# EAGLE design OP_Current_Fun-V0 (EAGLE 6.3)
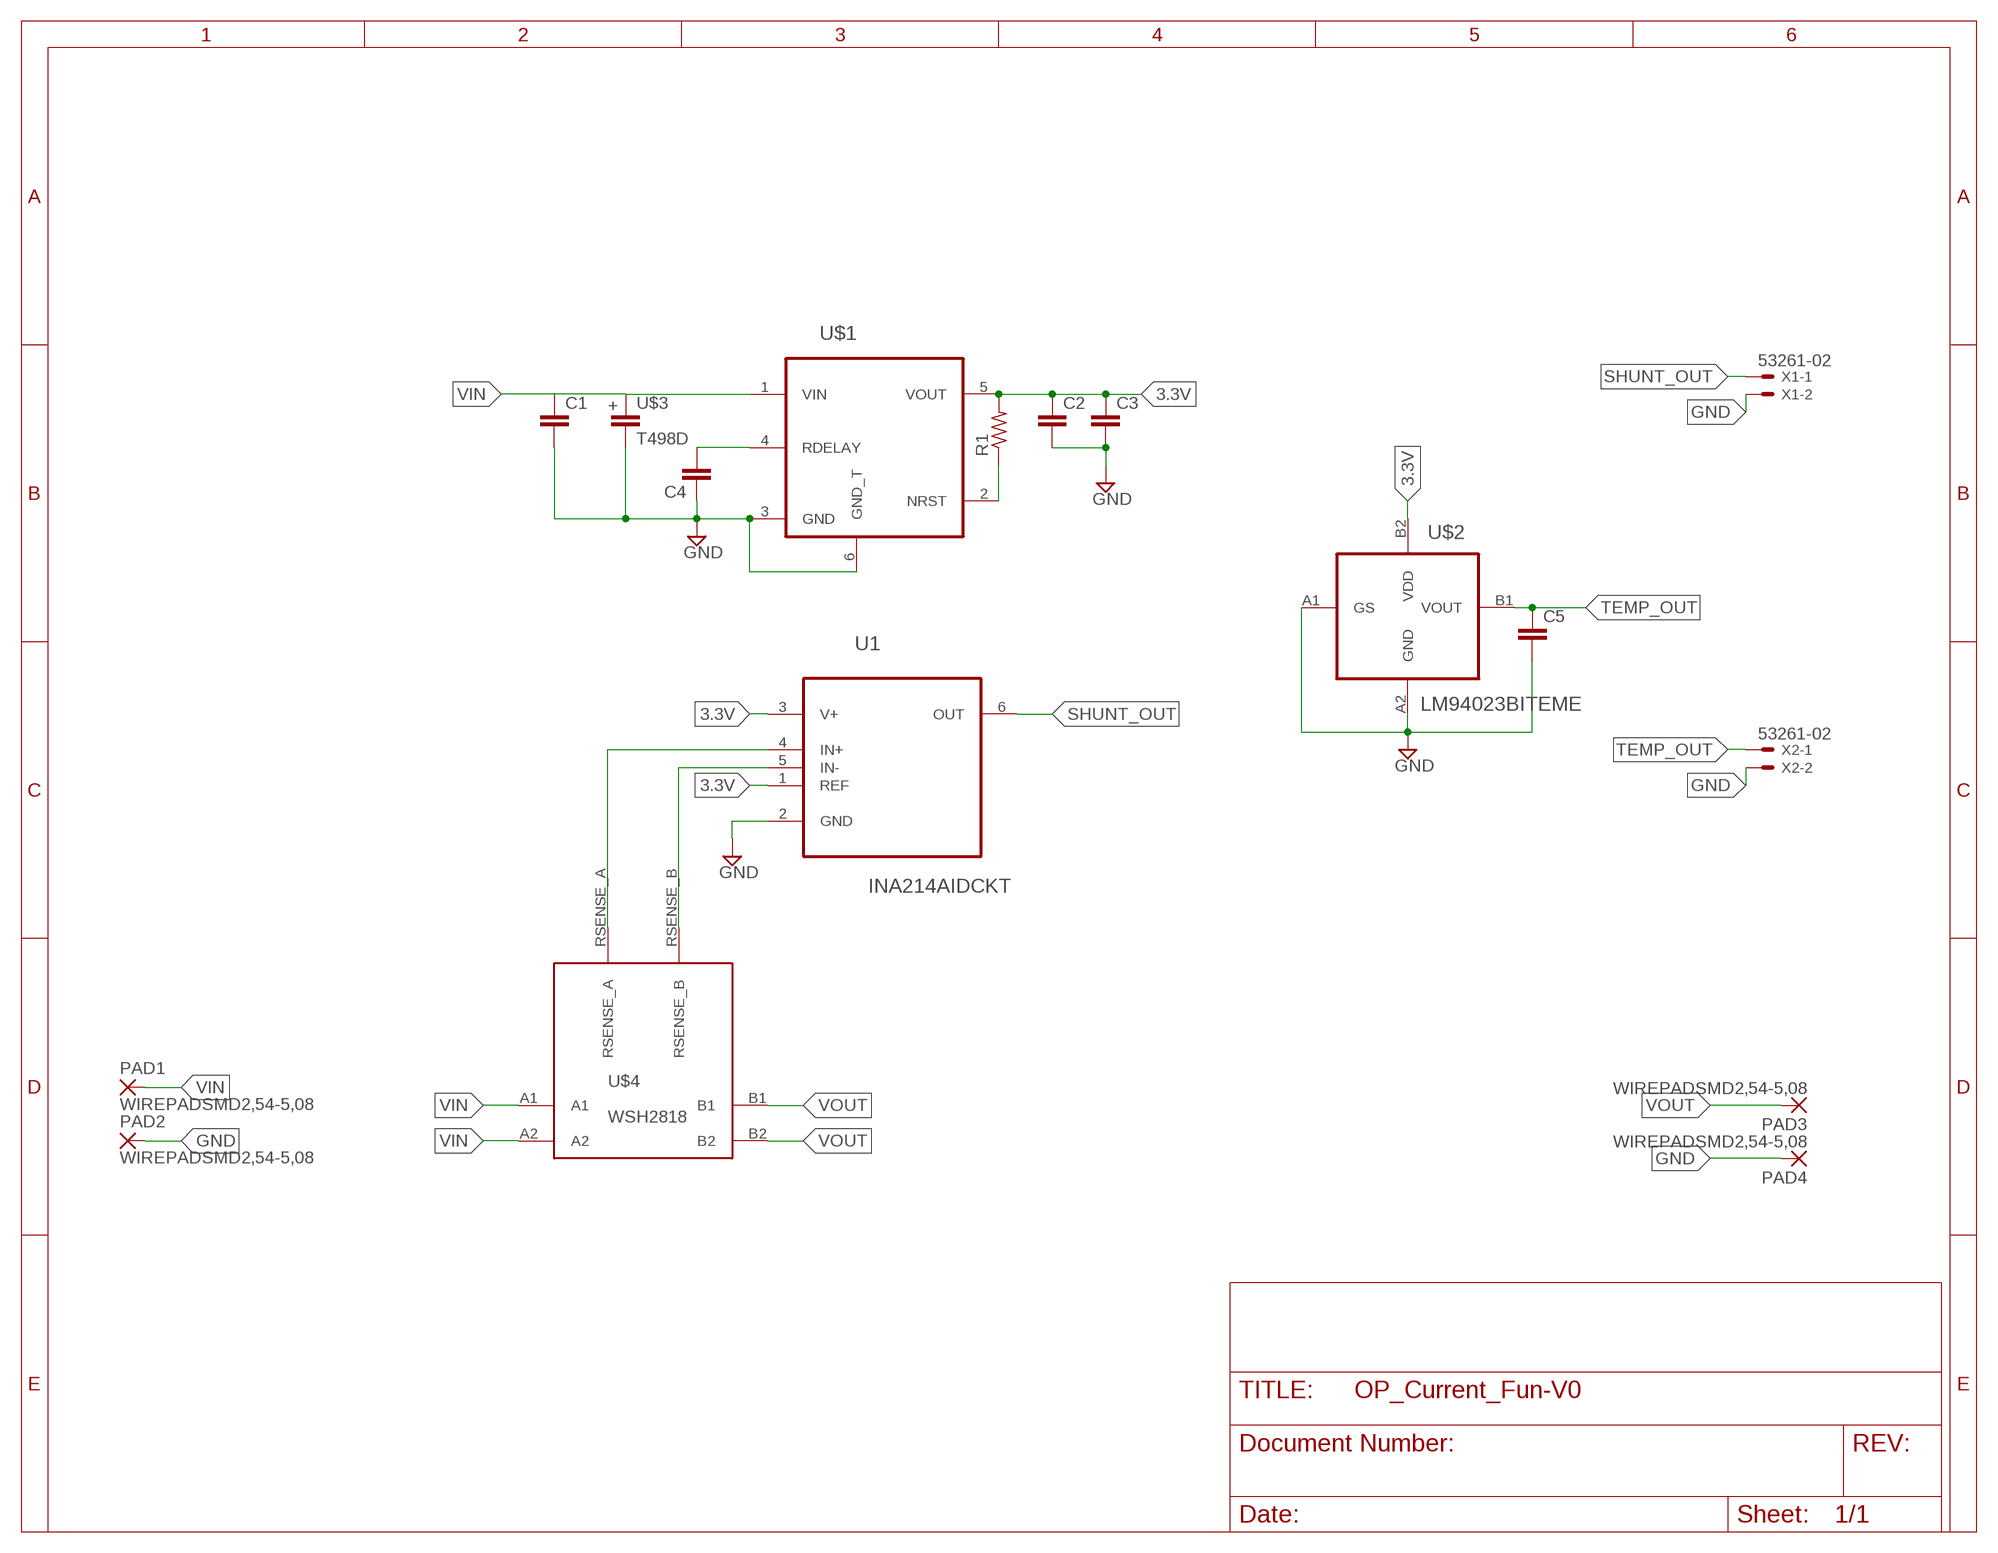
[diagram p0: schematic, sheet 1]

## Parts
C1  C-EUC0603K  [C0603K]
C2  C-EUC0603K  [C0603K]
C3  C-EUC0603K  [C0603K]
C4  C-EUC0805K  [C0805K]
C5  C-EUC0603K  [C0603K]
PAD1  WIREPADSMD2,54-5,08  [SMD2,54-5,08]
PAD2  WIREPADSMD2,54-5,08  [SMD2,54-5,08]
PAD3  WIREPADSMD2,54-5,08  [SMD2,54-5,08]
PAD4  WIREPADSMD2,54-5,08  [SMD2,54-5,08]
R1  R-US_R0402  [R0402]
U1  INA214AIDCKT  [SOT65P210X110-6N]
U$1  TPS7A6033-Q1  [TO-263-5]
U$2  LM94023BITEME  [BGA4C40P2X2_76X76X63]
U$3  T498D  [CT7343]
U$4  WSH2818  [2818]
X1  53261-02  [53261-02]
X2  53261-02  [53261-02]

## Nets
3.3V: C2.1 C3.1 R1.2 U1.1(REF) U1.3(V+) U$1.5(VOUT) U$2.B2(VDD)
GND: C1.2 C2.2 C3.2 C4.1 C5.2 PAD2.1(P) PAD4.1(P) U1.2(GND) U$1.3(GND) U$1.6(GND_T) U$2.A1(GS) U$2.A2(GND) U$3.- X1.2 X2.2
N$1: U1.4(IN+) U$4.RSENSE_A
N$2: U1.5(IN-) U$4.RSENSE_B
N$4: C4.2 U$1.4(RDELAY)
N$9: R1.1 U$1.2(NRST)
SHUNT_OUT: U1.6(OUT) X1.1
TEMP_OUT: C5.1 U$2.B1(VOUT) X2.1
VIN: C1.1 PAD1.1(P) U$1.1(VIN) U$3.+ U$4.A1 U$4.A2
VOUT: PAD3.1(P) U$4.B1 U$4.B2

## Library data of the parts
C1-C5 = rcl:C-EU: CAPACITOR, European symbol
PAD1-PAD4 = wirepad:WIREPAD: Wire PAD connect wire on PCB
R1 = rcl:R-US_: RESISTOR, American symbol
U1 = TI:INA214AIDCKT: CURRENT SHUNT MONITOR; MPN: INA214AIDCKT; OC_FARNELL: 1754262; OC_NEWARK: 05N1041; PACKAGE: SC-70-6; SUPPLIER: Texas Instruments
U$1 = TI_TPS:TPS7A6033-Q1: TPS7A6033-Q1
U$2 = TI:LM94023BITEME
U$3 = Kemet:T498D: Kemet T498 D series Tantalum SMD Cap
U$4 = VISHAY:WSH2818
X1 X2 = con-molex:53?-02: CONNECTOR wire to board 1.25 mm (.049 inch) pitch header; OC_FARNELL: 1125373; OC_NEWARK: unknown

## Board
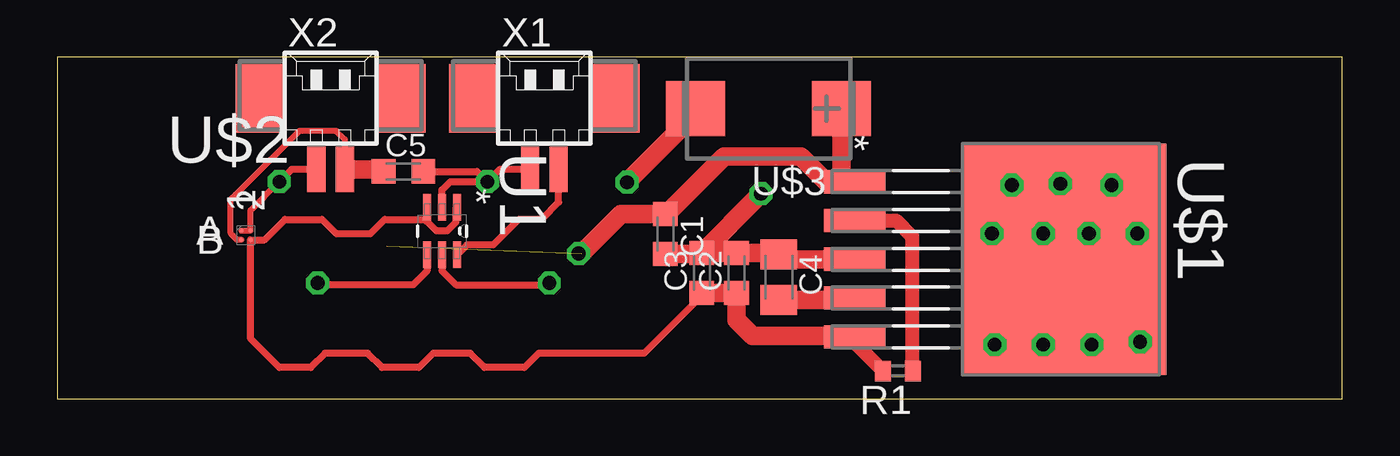
[diagram p1: board, top side]
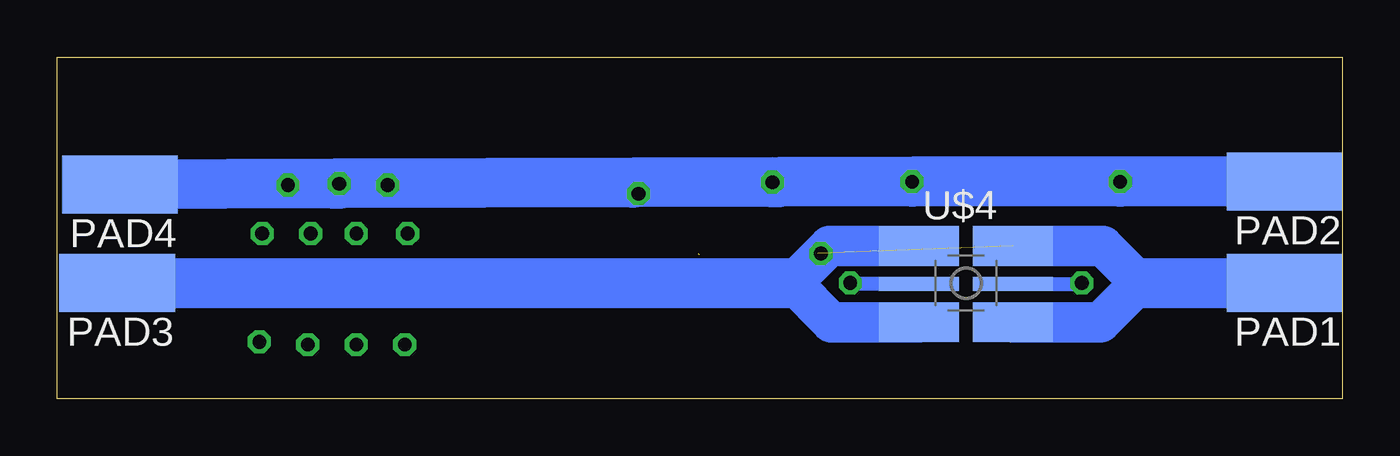
[diagram p2: board, bottom side, seen from below]

Size 56.38 x 15 mm. Coordinates in mm from the lower left corner, seen from the top.
Outline: 0,0 56.38,0 56.38,15 0,15 0,0
Copper layers (1*16): Top 0.035mm / dielectric 1.5mm / Bottom 0.035mm
Design rules "default": minimum track width 10mil, minimum drill 24mil, track to track 8mil, track to pad 8mil, pad to pad 8mil, via to via 8mil, smd to smd 8mil, copper to edge 40mil, drill to drill 8mil, minimum pad ring 10mil, minimum via ring 8mil, stop-mask expansion 4mil, vias tented up to drill 0mil, thermal gap 10mil

### Footprints (pad centres in the part's own frame; a part is rotated, then mirrored left to right if it is on the bottom)
C0603K = smd 1.05 x 1.08: 1 -0.875,0; 2 0.875,0
C0805K = smd 1.3 x 1.6: 1 -1,0; 2 1,0
SMD2,54-5,08 = smd 2.54 x 5.08: 1 0,0
R0402 = smd 0.7 x 0.9: 1 -0.65,0; 2 0.65,0
SOT65P210X110-6N = smd 1.168 x 0.356: 1 -1.041,0.66; 2 -1.041,0; 3 -1.041,-0.66; 4 1.041,-0.66; 5 1.041,0; 6 1.041,0.66
TO-263-5 = smd 1.016 x 2.692: 1 -3.404,-7.772; 2 -1.702,-7.772; 3 0,-7.772; 4 1.702,-7.772; 5 3.404,-7.772 | smd 10.16 x 8.941: 6 0,1.422
BGA4C40P2X2_76X76X63 = smd 0.203 x 0.203: A1 -0.203,0.203; A2 0.203,0.203; B1 -0.203,-0.203; B2 0.203,-0.203
CT7343 = smd 2.6 x 2.4: + -3.2,0; - 3.2,0
2818 = smd 3.5 x 1.75: A1 2.061,1.625; A2 2.061,-1.719; B1 -2.061,1.625; B2 -2.061,-1.719 | smd 3.5 x 0.6: RSENSE_A 2.061,-0.044; RSENSE_B -2.061,-0.044
53261-02 = smd 0.8 x 2: 1 0.625,-2.5; 2 -0.625,-2.5 | smd 2.1 x 3: S1 3.125,0.625; S2 -3.125,0.625

### Placement (x,y rotation side)
C1  26.68,7.24 270 top
C2  29.8,5.51 90 top
C3  28.28,5.51 90 top
C4  31.66,5.33 270 top
C5  15.19,9.98 0 top
PAD1  2.54,5.08 90 bottom
PAD2  2.54,9.53 90 bottom
PAD3  53.74,5.08 90 bottom
PAD4  53.62,9.4 90 bottom
R1  36.88,1.22 180 top
U1  16.89,7.36 270 top
U$1  42.75,6.12 270 top
U$2  8.29,7.18 0 top
U$3  31.2,12.73 180 top
U$4  16.51,5.08 0 bottom
X1  21.38,12.56 0 top
X2  12,12.56 0 top

### Tracks (layer width: path | path; a pad name or v marks a point on that pad's centre or on a via)
3.3V
  Top 0.305: U1.3 16.23,7.78 | 16.23,7.78 16.62,7.38 17.12,7.38 17.5,7.75 17.5,8.36 U1.1 | C3.1 28.28,4.53 25.75,2 21.12,2 20.5,1.38 18.75,1.38 18.12,2 16.5,2 15.88,1.38 14.25,1.38 13.62,2 11.75,2 11.12,1.38 9.75,1.38 8.5,2.62 8.5,6.96 U$2.B2 9.1,6.98 10,7.88 11.62,7.88 12.25,7.25 13.75,7.25 14.38,7.88 16.12,7.88 16.23,7.78
  Top 0.61: U$1.5 34.98,2.47 R1.2
  Top 0.813: C3.1 C2.1 29.8,3.45 30.5,2.75 34.94,2.75 U$1.5
GND  (via drill 0.6)  (1 unrouted)
  Top 0.254: v9.75,9.53 8.49,8.26 U$2.A2 U$2.A1
  Top 0.305: X1.2 19.41,10.06 v18.88,9.53 | U1.2 16.89,9.16 17.25,9.53 v18.88,9.53 | X2.2 10.29,10.06 v9.75,9.53 | C5.2 18.42,9.98 v18.88,9.53
  Top 0.813: U$1.3 31.88,6.12 C4.1 31.61,6.39 C2.2 C3.2 28.25,6.36 C1.2 26.68,6.32 | U$3.- 28,12.51 v25,9.5 | 28.19,6.32 v30.88,9
  Top 2.184: U$1.6 44.17,9.26 v44,9.44
  Bottom 0.813: v25,9.5 24.75,9.5 | v30.88,9 30.88,9.23 31.13,9.48
  Bottom 1.778: 24.75,9.5 v25,9.5
  Bottom 2.184: PAD2.1 v9.75,9.53 v18.88,9.53 24.75,9.5 | v25,9.5 31.13,9.48 v44,9.44 | v44,9.44 44.25,9.43 | 44.25,9.43 PAD4.1 | v44,9.44 44.25,9.44 44.25,9.43
N$1  (via drill 0.6)
  Top 0.305: U1.4 16.23,5.6 15.62,5 11.51,5 v11.43,5.08
  Bottom 0.61: U$4.RSENSE_A 11.47,5.04 v11.43,5.08
N$2  (via drill 0.6)
  Top 0.305: U1.5 16.89,5.62 17.5,5 21.51,5 v21.59,5.08
  Bottom 0.61: U$4.RSENSE_B 21.55,5.04 v21.59,5.08
N$3  (via drill 0.6)
  other vias: 22.88,6.38
N$4
  Top 0.813: C4.2 34.89,4.33 U$1.4
N$5  (via drill 0.6)
  other vias: 41.88,9.38
N$6  (via drill 0.6)
  other vias: 46.25,9.38
N$7  (via drill 0.6)
  other vias: 41.12,2.38
N$8  (via drill 0.6)
  other vias: 43.25,2.38
N$9
  Top 0.61: U$1.2 36.8,7.82 37.5,7.12 37.5,1.25 R1.1
N$10  (via drill 0.6)
  other vias: 45.38,2.38
N$11  (via drill 0.6)
  other vias: 47.5,2.5
N$12  (via drill 0.6)
  other vias: 41,7.25
N$13  (via drill 0.6)
  other vias: 43.25,7.25
N$14  (via drill 0.6)
  other vias: 45.25,7.25
N$15  (via drill 0.6)
  other vias: 47.38,7.25
SHUNT_OUT
  Top 0.305: X1.1 22,8.62 21.25,7.88 20.25,7.88 19.12,6.75 17.98,6.75 U1.6
TEMP_OUT
  Top 0.254: X2.1 12.62,11.38 12.25,11.75 10.62,11.75 7.62,8.75 7.62,7.25 7.9,6.98 U$2.B1
  Top 0.813: X2.1 14.23,10.06 C5.1
VIN  (1 unrouted)
  Top 0.813: 34.38,9.5 34.95,9.5 U$1.1 | U$3.+ 34.41,9.53 34.38,9.5 | 23,6.38 24.73,8.11 C1.1 26.73,8.11 27.88,9.25 28.12,9.5 29.25,10.62 32.62,10.62 33.75,9.5 34.38,9.5
  Bottom 1.778: U$4.A1 10.52,6.71 8.89,5.08 10.61,3.36 U$4.A2
  Bottom 2.184: 8.89,5.08 PAD1.1
VOUT
  Bottom 1.778: U$4.B1 22.5,6.71 24.13,5.08 22.41,3.36 U$4.B2
  Bottom 2.184: PAD3.1 24.13,5.08